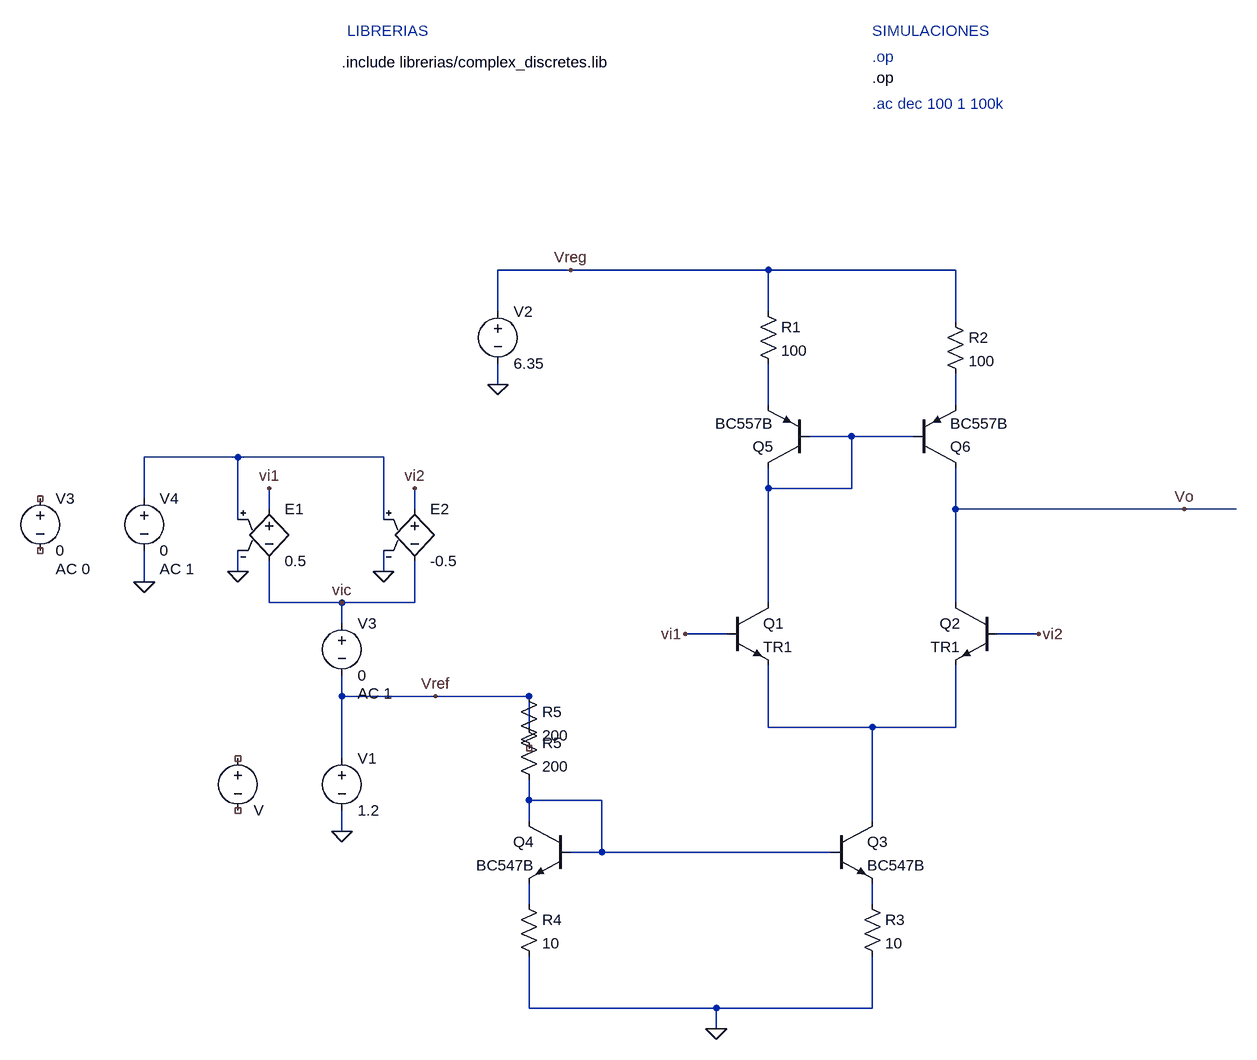
[diagram p0: schematic par_diferencial.asc]
par_diferencial.asc, the LTspice schematic file:
Version 4
SHEET 1 880 836
WIRE -192 -400 -304 -400
WIRE 112 -400 -192 -400
WIRE 400 -400 112 -400
WIRE -304 -336 -304 -400
WIRE 112 -336 112 -400
WIRE 400 -320 400 -400
WIRE -304 -224 -304 -256
WIRE 112 -192 112 -256
WIRE 400 -192 400 -240
WIRE 240 -144 176 -144
WIRE 336 -144 240 -144
WIRE -704 -112 -848 -112
WIRE -480 -112 -704 -112
WIRE 112 -64 112 -96
WIRE 240 -64 240 -144
WIRE 240 -64 112 -64
WIRE -848 -48 -848 -112
WIRE -656 -32 -656 -64
WIRE -432 -32 -432 -64
WIRE 400 -32 400 -96
WIRE 752 -32 400 -32
WIRE 832 -32 752 -32
WIRE -704 -16 -704 -112
WIRE -480 -16 -480 -112
WIRE -704 64 -704 32
WIRE -480 64 -480 32
WIRE -848 80 -848 32
WIRE -656 112 -656 48
WIRE -544 112 -656 112
WIRE -432 112 -432 48
WIRE -432 112 -544 112
WIRE 112 112 112 -64
WIRE 400 112 400 -32
WIRE -544 144 -544 112
WIRE 48 160 -16 160
WIRE 528 160 464 160
WIRE -544 256 -544 224
WIRE -400 256 -544 256
WIRE -256 256 -400 256
WIRE -256 304 -256 256
WIRE 112 304 112 208
WIRE 272 304 112 304
WIRE 400 304 400 208
WIRE 400 304 272 304
WIRE -544 352 -544 256
WIRE -256 416 -256 384
WIRE -144 416 -256 416
WIRE -256 448 -256 416
WIRE 272 448 272 304
WIRE -544 464 -544 432
WIRE -144 496 -144 416
WIRE -144 496 -192 496
WIRE 208 496 -144 496
WIRE -256 576 -256 544
WIRE 272 576 272 544
WIRE -256 736 -256 656
WIRE 32 736 -256 736
WIRE 272 736 272 656
WIRE 272 736 32 736
WIRE 32 768 32 736
FLAG -304 -224 0
FLAG -544 464 0
FLAG 32 768 0
FLAG -192 -400 Vreg
FLAG 752 -32 Vo
FLAG -848 80 0
FLAG -704 64 0
FLAG -480 64 0
FLAG -656 -64 vi1
FLAG -432 -64 vi2
FLAG -400 256 Vref
FLAG -544 112 vic
FLAG -16 160 vi1
FLAG 528 160 vi2
DATAFLAG 640 -32 ""
DATAFLAG 112 -16 ""
SYMBOL npn 48 112 R0
SYMATTR InstName Q1
SYMATTR Value TR1
SYMBOL npn 464 112 M0
SYMATTR InstName Q2
SYMATTR Value TR1
SYMBOL npn 208 448 R0
SYMATTR InstName Q3
SYMATTR Value BC547B
SYMBOL npn -192 448 M0
SYMATTR InstName Q4
SYMATTR Value BC547B
SYMBOL pnp 176 -96 R180
SYMATTR InstName Q5
SYMATTR Value BC557B
SYMBOL pnp 336 -96 M180
SYMATTR InstName Q6
SYMATTR Value BC557B
SYMBOL res 96 -352 R0
SYMATTR InstName R1
SYMATTR Value 100
SYMBOL res 384 -336 R0
SYMATTR InstName R2
SYMATTR Value 100
SYMBOL res 256 560 R0
SYMATTR InstName R3
SYMATTR Value 10
SYMBOL res -272 560 R0
SYMATTR InstName R4
SYMATTR Value 10
<<<<<<< HEAD
SYMBOL res -272 240 R0
SYMATTR InstName R5
SYMATTR Value 200
SYMBOL voltage -704 336 R0
=======
SYMBOL res -272 288 R0
SYMATTR InstName R5
SYMATTR Value 200
SYMBOL voltage -544 336 R0
>>>>>>> 754c580173216dad52f4b9261c058b24249291d2
WINDOW 123 0 0 Left 0
WINDOW 39 0 0 Left 0
SYMATTR InstName V1
SYMATTR Value 1.2
SYMBOL voltage -304 -352 R0
WINDOW 123 0 0 Left 0
WINDOW 39 0 0 Left 0
SYMATTR InstName V2
SYMATTR Value 6.35
SYMBOL e -656 -48 R0
SYMATTR InstName E1
SYMATTR Value 0.5
SYMBOL e -432 -48 R0
SYMATTR InstName E2
SYMATTR Value -0.5
SYMBOL voltage -544 128 R0
WINDOW 123 24 124 Left 2
WINDOW 39 0 0 Left 0
<<<<<<< HEAD
SYMATTR Value2 AC 1
SYMATTR InstName V3
SYMATTR Value 0
SYMBOL voltage -1008 -64 R0
WINDOW 123 24 124 Left 2
WINDOW 39 0 0 Left 0
SYMATTR Value2 AC 0
=======
SYMATTR Value2 AC 0
SYMATTR InstName V3
SYMATTR Value 0
SYMBOL voltage -848 -64 R0
WINDOW 123 24 124 Left 2
WINDOW 39 0 0 Left 0
SYMATTR Value2 AC 1
>>>>>>> 754c580173216dad52f4b9261c058b24249291d2
SYMATTR InstName V4
SYMATTR Value 0
TEXT -544 -720 Left 2 !.include librerias/complex_discretes.lib
TEXT -536 -768 Left 2 ;LIBRERIAS
TEXT 272 -768 Left 2 ;SIMULACIONES
TEXT 272 -728 Left 2 ;.op
TEXT 272 -696 Left 2 !.op
TEXT 272 -656 Left 2 ;.ac dec 100 1 100k

The netlist it stands for:
* par_diferencial.asc
Q1 N003 vi1 N005 0 TR1
Q2 Vo vi2 N005 0 TR1
Q3 N005 N006 N008 0 BC547B
Q4 N006 N006 N007 0 BC547B
Q5 N003 N003 N001 0 BC557B
Q6 Vo N003 N002 0 BC557B
R1 Vreg N001 100
R2 Vreg N002 100
R3 N008 0 10
R4 N007 0 10
R5 Vref NC_01 200
V§? NC_02 NC_03 V
R5 Vref N006 200
V1 Vref 0 1.2
V2 Vreg 0 6.35
E1 vi1 vic N004 0 0.5
E2 vi2 vic N004 0 -0.5
V3 vic Vref 0 AC 1
V3 NC_04 NC_05 0 AC 0
V4 N004 0 0 AC 1
.model NPN NPN
.model PNP PNP
.lib standard.bjt
.include librerias/complex_discretes.lib
* LIBRERIAS
* SIMULACIONES
* .op
.op
* .ac dec 100 1 100k
.backanno
.end